# EAGLE design nRF52810 Beacon (EAGLE 9.6.2)
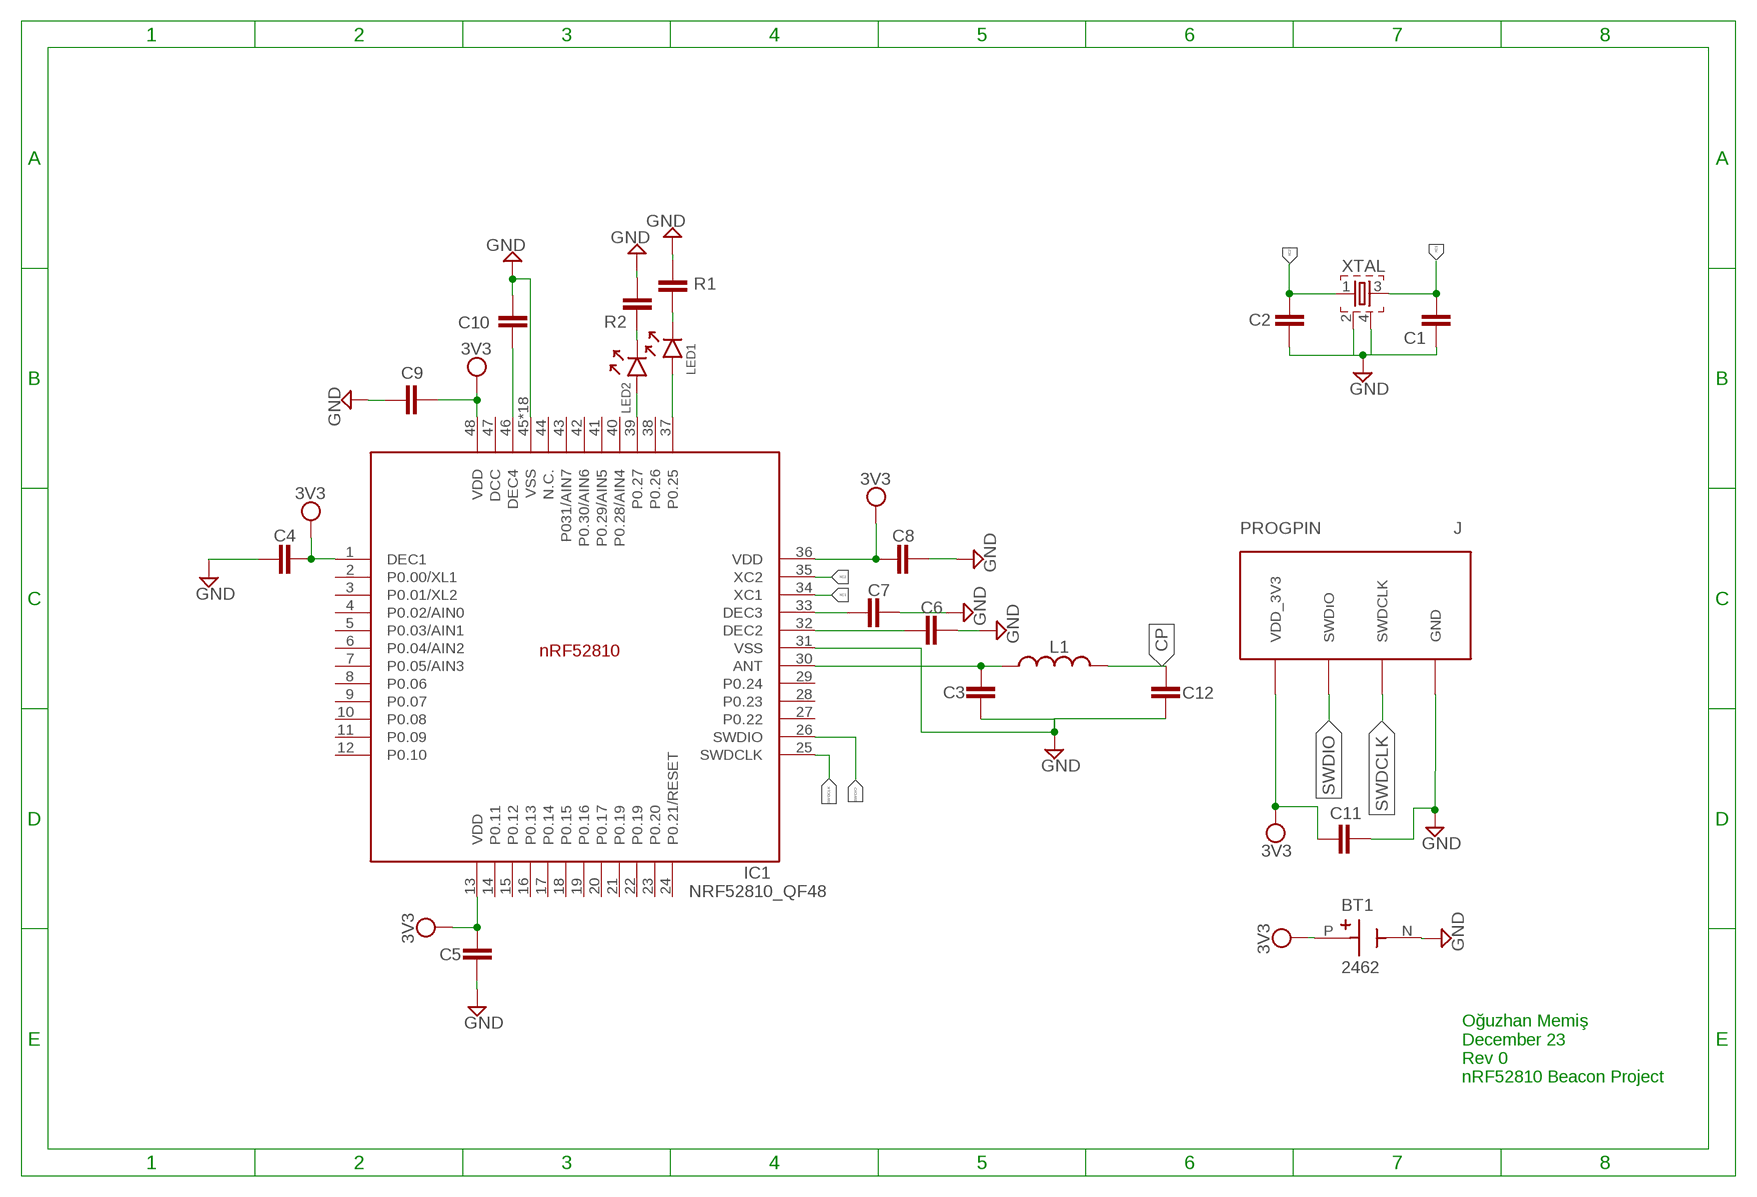
[diagram p0: schematic, sheet 1]

## Parts
BT1  2462  [BAT_2462]
C1  12pF  CAPACITOR_0402_N  [RESC0402_N]
C2  12pF  CAPACITOR_0402_N  [RESC0402_N]
C3  0.8pF  CAPACITOR_0402_N  [RESC0402_N]
C4  100nF  CAPACITOR_0402_N  [RESC0402_N]
C5  100nF  CAPACITOR_0402_N  [RESC0402_N]
C6  100pF  CAPACITOR_0402_N  [RESC0402_N]
C7  100pF  CAPACITOR_0402_N  [RESC0402_N]
C8  100nF  CAPACITOR_0402_N  [RESC0402_N]
C9  4.7uF  CAPACITOR_0603_N  [RESC0603_N]
C10  1uF  CAPACITOR_0603_N  [RESC0603_N]
C11  100nF  CAPACITOR_0603_N  [RESC0603_N]
C12  1.2pF  CAPACITOR_0402_N  [RESC0402_N]
IC1  NRF52810_QF48  [QFN40P600X600X90-48_N]
L1  3.9nF  INDUCTOR_0402_N  [RESC0402_N]
LED1  LED  [DIOC0603_N]
LED2  LED  [DIOC0603_N]
R1  560R  CAPACITOR_0603_N  [RESC0603_N]
R2  560R  CAPACITOR_0603_N  [RESC0603_N]
U$1  PROGPIN4*2.54  [PROGPIN]
XTAL  32MHz SMD2016  XTAL_32MHZ  [BT-XTAL_2016_N]

## Nets
CP: C12.1 L1.2
GND: BT1.N(NEG) C1.1 C2.1 C3.2 C4.1 C5.2 C6.2 C7.2 C8.2 C9.1 C10.2 C11.2 C12.2 IC1.31(VSS) IC1.45(VSS) IC1.PAD(VSS) IC1.PAD@VIA01(VSS) IC1.PAD@VIA02(VSS) IC1.PAD@VIA03(VSS) IC1.PAD@VIA04(VSS) IC1.PAD@VIA05(VSS) IC1.PAD@VIA06(VSS) IC1.PAD@VIA07(VSS) IC1.PAD@VIA08(VSS) IC1.PAD@VIA09(VSS) IC1.PAD@VIA10(VSS) IC1.PAD@VIA11(VSS) IC1.PAD@VIA12(VSS) IC1.PAD@VIA13(VSS) IC1.PAD@VIA14(VSS) IC1.PAD@VIA15(VSS) IC1.PAD@VIA16(VSS) R1.2 R2.2 U$1.GND XTAL.2 XTAL.4
N$1: IC1.39(P0.27) LED2.2(A)
N$2: LED2.1(C) R2.1
N$3: C7.1 IC1.33(DEC3)
N$4: C6.1 IC1.32(DEC2)
N$5: IC1.37(P0.25) LED1.2(A)
N$11: C3.1 IC1.30(ANT) L1.1
N$14: C10.1 IC1.46(DEC4)
N$18: LED1.1(C) R1.1
SWDCLK: IC1.25(SWDCLK) U$1.SWDCLK
SWDIO: IC1.26(SWDIO) U$1.SWDIO(SWDıO)
VDD: BT1.P(POS) C4.2 C5.1 C8.1 C9.2 C11.1 IC1.1(DEC1) IC1.13(VDD) IC1.36(VDD) IC1.48(VDD) U$1.VDD_3V3
XC1: C1.2 IC1.34(XC1) XTAL.3
XC2: C2.2 IC1.35(XC2) XTAL.1
Unconnected: IC1.2(P0.00/XL1) IC1.3(P0.01/XL2) IC1.4(P0.02/AIN0) IC1.5(P0.03/AIN1) IC1.6(P0.04/AIN2) IC1.7(P0.05/AIN3) IC1.8(P0.06) IC1.9(P0.07) IC1.10(P0.08) IC1.11(P0.09) IC1.12(P0.10) IC1.14(P0.11) IC1.15(P0.12) IC1.16(P0.13) IC1.17(P0.14) IC1.18(P0.15) IC1.19(P0.16) IC1.20(P0.17) IC1.21(P0.19) IC1.22(P0.19) IC1.23(P0.20) IC1.24(P0.21/RESET) IC1.27(P0.22) IC1.28(P0.23) IC1.29(P0.24) IC1.38(P0.26) IC1.40(P0.28/AIN4) IC1.41(P0.29/AIN5) IC1.42(P0.30/AIN6) IC1.43(P031/AIN7) IC1.44(N.C.) IC1.47(DCC)

## Notes on the sheet
- Oğuzhan Memiş 
  December 23
  Rev 0
  nRF52810 Beacon Project

## Library data of the parts
BT1 = 2462:2462: Check availability <https://pricing.snapeda.com/parts/2462/Keystone/view-part?ref=eda>; AVAILABILITY: In Stock; CHECK_PRICES: https://www.snapeda.com/parts/2462/Keystone+Electronics/view-part/?ref=eda; DESCRIPTION: Battery Holder, AA, Polypropylene, PC Mount, 2, Spring, PC Lug | Keystone Electronics 2462; MF: Keystone; MP: 2462; PACKAGE: None; PRICE: None; SNAPEDA_LINK: https://www.snapeda.com/parts/2462/Keystone+Electronics/view-part/?ref=snap
C1-C12 R1 R2 = Nordic_nRF:CAPACITOR: Generic chip capacitor
IC1 = Nordic_nRF:NRF52810_QF48: nRF52810 Features Single chip, highly flexible, 2.4 GHz multi-protocol SoC 32-bit ARM Cortex-M4 Processor 1.7v to 3.6v operation 192kB flash + 24kB RAM Supports concurrent Bluetooth low energy/ANT protocol operation Up to +4dBm output power -96dBm sensitivity, Bluetooth low energy Thread safe and run-time protected Event driven API On air compatible with nRF24L and nRF24AP series 2 data rates (2Mbps/1Mbps) PPI - maximum flexibility for power-efficient applications and code simplification Automated power management system with automatic power management of each peripheral Configurable I/O mapping for analog and digital I/O 1 x Master/Slave SPI 1 x Two-wire interface (I²C) UART (RTS/CTS) 1 x PWM (4 channels) AES HW encryption 8-channel 10/12-bit ADC Quadrature decoder 64-level analog comparator Real Time Counter (RTC) Digital microphone interface (PDM) On-chip balun Applications Bluetooth 5 connectivity processor Industrial sensors and actuators Wearables SmartHome sensors computer peripherals RF smart remotes Airfuel (A4WP) wireless charging Beacons Sports and fitness sensors Connected health products Smart watches RC Toys Interactive games Building automation
L1 = Nordic_nRF:INDUCTOR: Generic chip inductor
LED1 LED2 = Nordic_misc:LED
U$1 = 2023Poi:PROGPIN
XTAL = Nordic_nRF:XTAL_32MHZ

## Board
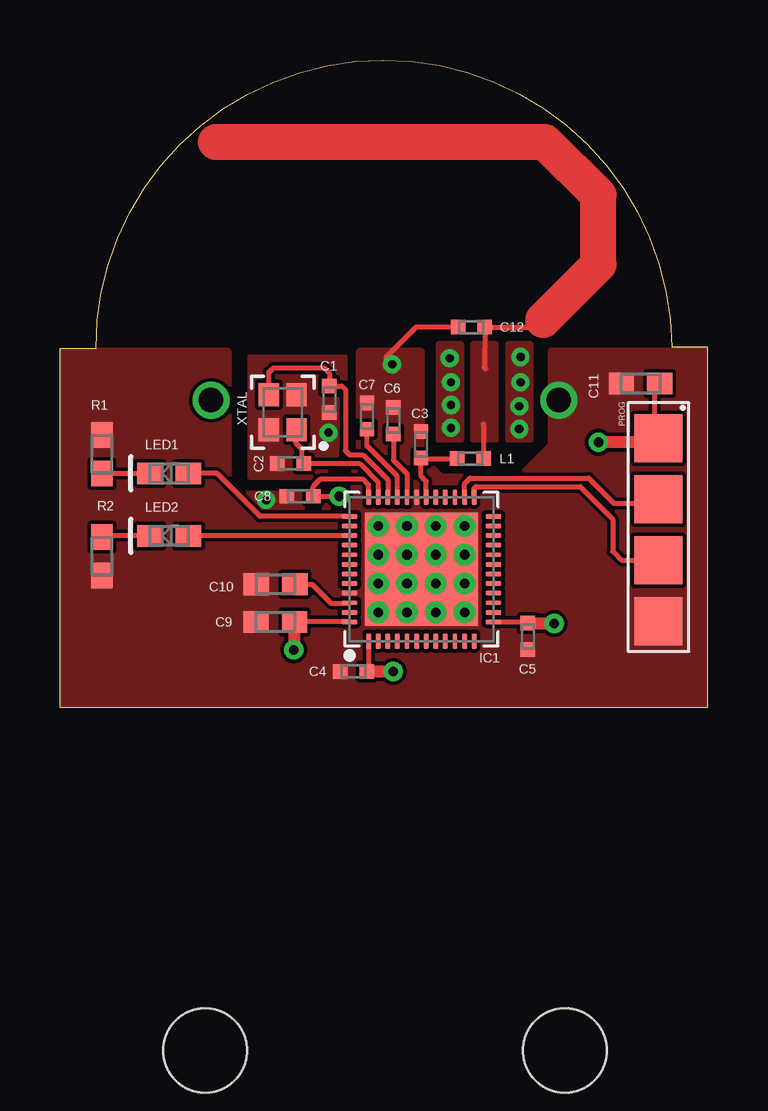
[diagram p1: board, top side]
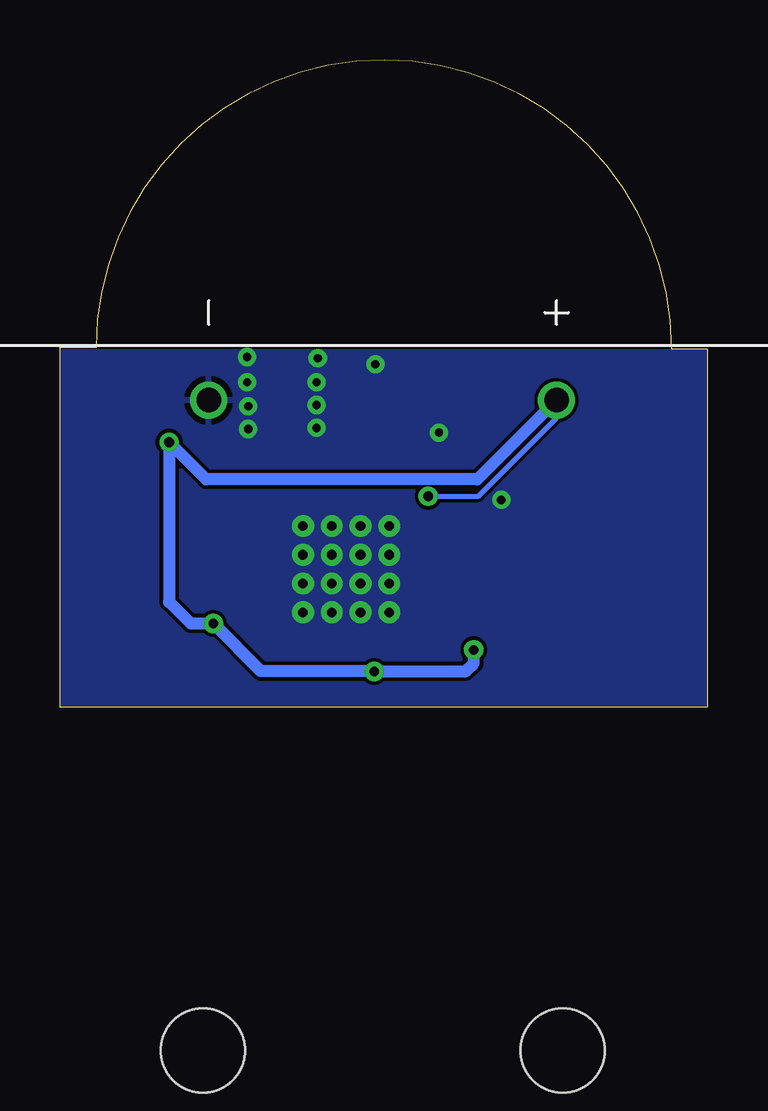
[diagram p2: board, bottom side, seen from below]

Size 27 x 26.98 mm. Coordinates in mm from the lower left corner, seen from the top.
Outline: 0,0 0,14.95 1.5,14.95 arc-180 25.5,15 27,15 27,0 0,0
Copper layers (1*16): Top 0.035mm / dielectric 1.5mm / Bottom 0.035mm
Design rules "default *": minimum track width 4mil, minimum drill 0.35mm, track to track 6mil, track to pad 6mil, pad to pad 6mil, via to via 6mil, smd to smd 6mil, copper to edge 0.00126875mm, drill to drill 6mil, minimum pad ring 10mil, minimum via ring 8mil, stop-mask expansion 4mil, vias tented up to drill 0mil, thermal gap 10mil

### Footprints (pad centres in the part's own frame; a part is rotated, then mirrored left to right if it is on the bottom)
BAT_2462 = drill 1.02: N 27.1,7.25; P 27.1,-7.25 | hole 3.5: 0,7.5; 0,-7.5
RESC0402_N = smd 0.6 x 0.6: 1 -0.55,0; 2 0.55,0
RESC0603_N = smd 1.05 x 0.9: 1 -0.8,0; 2 0.8,0
QFN40P600X600X90-48_N = smd 0.65 x 0.2: 1 -3,2.2; 2 -3,1.8; 3 -3,1.4; 4 -3,1; 5 -3,0.6; 6 -3,0.2; 7 -3,-0.2; 8 -3,-0.6; 9 -3,-1; 10 -3,-1.4; 11 -3,-1.8; 12 -3,-2.2; 25 3,-2.2; 26 3,-1.8; 27 3,-1.4; 28 3,-1; 29 3,-0.6; 30 3,-0.2; 31 3,0.2; 32 3,0.6; 33 3,1; 34 3,1.4; 35 3,1.8; 36 3,2.2 | smd 0.2 x 0.65: 13 -2.2,-3; 14 -1.8,-3; 15 -1.4,-3; 16 -1,-3; 17 -0.6,-3; 18 -0.2,-3; 19 0.2,-3; 20 0.6,-3; 21 1,-3; 22 1.4,-3; 23 1.8,-3; 24 2.2,-3; 37 2.2,3; 38 1.8,3; 39 1.4,3; 40 1,3; 41 0.6,3; 42 0.2,3; 43 -0.2,3; 44 -0.6,3; 45 -1,3; 46 -1.4,3; 47 -1.8,3; 48 -2.2,3 | smd 4.7 x 4.7: PAD 0,0 | drill 0.4: PAD@VIA01 -1.8,1.8; PAD@VIA02 -1.8,0.6; PAD@VIA03 -1.8,-0.6; PAD@VIA04 -1.8,-1.8; PAD@VIA05 -0.6,1.8; PAD@VIA06 -0.6,0.6; PAD@VIA07 -0.6,-0.6; PAD@VIA08 -0.6,-1.8; PAD@VIA09 0.6,1.8; PAD@VIA10 0.6,0.6; PAD@VIA11 0.6,-0.6; PAD@VIA12 0.6,-1.8; PAD@VIA13 1.8,1.8; PAD@VIA14 1.8,0.6; PAD@VIA15 1.8,-0.6; PAD@VIA16 1.8,-1.8
DIOC0603_N = smd 1.05 x 0.9: 1 -0.8,0; 2 0.8,0
PROGPIN = smd 2 x 2: GND 7.62,0; SWDCLK 5.08,0; SWDIO 2.54,0; VDD_3V3 0,0
BT-XTAL_2016_N = smd 0.95 x 0.85: 1 -0.725,-0.575; 2 0.725,-0.575; 3 0.725,0.575; 4 -0.725,0.575

### Placement (x,y rotation side)
BT1  13.55,-14.3 90 bottom
C1  11.23,12.84 90 top
C2  9.61,10.17 0 top
C3  15.05,10.94 90 top
C4  12.24,1.5 0 top
C5  19.5,2.96 270 top
C6  13.9,11.94 90 top
C7  12.8,12.14 90 top
C8  10.01,8.8 180 top
C9  8.98,3.56 0 top
C10  8.99,5.13 180 top
C11  24.2,13.5 180 top
C12  17.16,15.85 180 top
IC1  15.07,5.76 90 top
L1  17.12,10.37 0 top
LED1  4.55,9.75 0 top
LED2  4.55,7.15 0 top
R1  1.75,10.55 90 top
R2  1.75,6.3 270 top
U$1  24.95,11.22 270 top
XTAL  9.29,12.3 90 top

### Tracks (layer width: path | path; a pad name or v marks a point on that pad's centre or on a via)
CP
  Top 0.2: L1.2 17.67,11.78 17.65,11.8 | 17.75,14.1 17.69,14.16 C12.1 19.85,15.85 20.15,16.15
  Top 1.5: 6.49,23.55 20.21,23.55 22.45,21.35 22.45,18.45 20.15,16.15
  pour Top: 17.2,15.15 17.2,11.15 18.2,11.15 18.2,15.15
GND  (via drill 0.35)
  Top 0.2: C12.2 14.85,15.85 13.6,14.6 13.6,14.3 13.9,14
  other vias: 13.85,14.3 16.25,14.55 16.3,13.55 16.3,12.6 16.3,11.65 19.2,14.6 19.2,13.55 19.15,12.55 19.15,11.6 11.2,11.45 8.6,8.65
  pour Top: 15.75,11.15 16.75,11.15 16.75,15.15 15.75,15.15
  pour Top: 18.65,15.15 18.65,11.15 19.65,11.15 19.65,15.15
  pour Top (no thermals): 7.9,14.6 7.9,9.6 10.85,9.6 11.55,10.3 11.55,10.95 11.9,10.95 11.9,14.6
  pour Top (no thermals): 26.9,14.9 26.9,0.1 0.1,0.1 0.1,14.85 0.15,14.9 7,14.9 7.05,14.85 7.05,9 7.1,8.95 11.35,8.95 12.45,10.05 12.45,14.85 12.5,14.9 15.05,14.9 15.1,14.85 15.1,10.45 15.9,9.65 19.15,9.65 20.45,10.95 20.45,14.9
  pour Bottom: 0.1,14.95 0.1,0.2 0.15,0.15 26.9,0.15 26.9,14.85 0.75,14.85 0.7,14.9 0.35,14.9 0.25,14.8
N$1
  Top 0.2: IC1.39 LED2.2
N$2
  Top 0.2: LED2.1 1.8,7.15 R2.1
N$3
  Top 0.2: IC1.33 14.07,9.63 12.8,10.9 C7.1
N$4
  Top 0.2: IC1.32 14.47,9.73 13.9,10.3 C6.1
N$5
  Top 0.2: IC1.37 8.34,7.96 6.55,9.75 LED1.2
N$11
  Top 0.2: IC1.30 15.27,9.43 15.05,9.65 C3.1 15.07,10.37 L1.1
N$14
  Top 0.2: C10.1 10.52,5.13 11.3,4.35 IC1.46
N$18
  Top 0.2: R1.1 LED1.1
SWDCLK
  Top 0.2: IC1.25 17.27,9.12 17.35,9.2 21.7,9.2 23.05,7.85 23.05,6.5 23.41,6.14 U$1.SWDCLK
SWDIO
  Top 0.2: IC1.26 16.87,9.32 17.1,9.55 22.05,9.55 23.1,8.5 24.77,8.5 U$1.SWDIO
VDD  (via drill 0.4)
  Top 0.2: IC1.1 12.87,1.58 C4.2 | IC1.13 19.45,3.56 C5.1 | IC1.48 C9.2 | IC1.36 12.87,9.28 12.65,9.5 10.85,9.5 10.56,9.21 C8.1 v11.65,8.8 | C11.1 24.78,13.28 24.78,11.05
  Top 0.5: U$1.VDD_3V3 24.78,11.05 v22.45,11.05 | C5.1 v20.59,3.51 v20.6,3.5 | C4.2 v13.9,1.5 | C9.2 9.75,3.53 v9.75,2.4
  Bottom 0.2: v11.65,8.8 9.55,8.8 6.3,12.05 BT1.P
  Bottom 0.5: BT1.P 9.6,9.5 20.9,9.5 v22.45,11.05 22.45,4.4 21.55,3.5 v20.6,3.5 18.62,1.52 13.92,1.52 v13.9,1.5 10.1,1.5 9.75,1.85 v9.75,2.4
XC1
  Top 0.2: XTAL.3 8.71,13.96 8.9,14.15 11,14.15 11.23,13.92 C1.2 11.76,13.39 11.9,13.25 11.9,10.7 12.08,10.52 12.63,10.52 13.67,9.48 IC1.34
XC2
  Top 0.2: IC1.35 13.27,9.38 12.48,10.17 C2.2 10.1,10.23 10.1,10.75 9.85,11 9.85,11.56 XTAL.1